# EAGLE schematic module_proto (EAGLE 7.1.0)
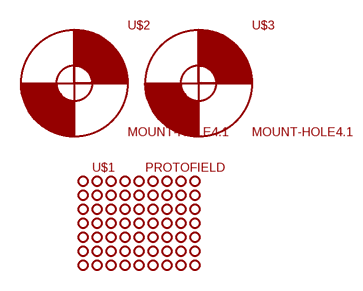
[diagram p0: schematic, sheet 1]

## Parts
U$1  PROTOFIELD  [PROTOFIELD-9X8]
U$2  MOUNT-HOLE4.1  [4.1]
U$3  MOUNT-HOLE4.1  [4.1]

## Library data of the parts
U$1 = robocraft:PROTOFIELD: protoshield pad for modules
U$2 U$3 = robocraft:MOUNT-HOLE: Mount hole